# Altium schematic sheet WiCAN_master.SchDoc
size A4; SheetNumber: 1; SheetTotal: 6
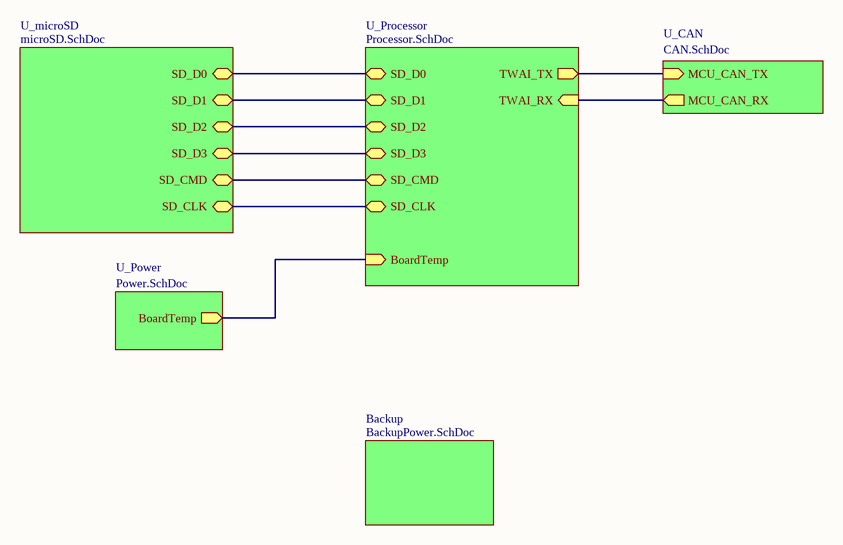
[diagram p0: WiCAN_master.SchDoc]

## Sub-sheets
Backup = BackupPower.SchDoc: no entries
U_CAN = CAN.SchDoc: MCU_CAN_TX (in), MCU_CAN_RX (out)
U_microSD = microSD.SchDoc: SD_D0 (bidir), SD_D1 (bidir), SD_D2 (bidir), SD_D3 (bidir), SD_CMD (bidir), SD_CLK (bidir)
U_Power = Power.SchDoc: BoardTemp (out)
U_Processor = Processor.SchDoc: SD_D0 (bidir), SD_D1 (bidir), SD_D2 (bidir), SD_D3 (bidir), SD_CMD (bidir), SD_CLK (bidir), TWAI_TX (out), TWAI_RX (in), BoardTemp (in)

## Nets
(unnamed): sheet U_Processor/SD_D0, sheet U_microSD/SD_D0
(unnamed): sheet U_Processor/SD_D1, sheet U_microSD/SD_D1
(unnamed): sheet U_Processor/SD_D2, sheet U_microSD/SD_D2
(unnamed): sheet U_Processor/SD_D3, sheet U_microSD/SD_D3
(unnamed): sheet U_Processor/SD_CMD, sheet U_microSD/SD_CMD
(unnamed): sheet U_Processor/SD_CLK, sheet U_microSD/SD_CLK
(unnamed): sheet U_Processor/TWAI_TX, sheet U_CAN/MCU_CAN_TX
(unnamed): sheet U_Processor/TWAI_RX, sheet U_CAN/MCU_CAN_RX
(unnamed): sheet U_Processor/BoardTemp, sheet U_Power/BoardTemp